# EAGLE schematic AudioCompressor_SCH (EAGLE 7.6.0)
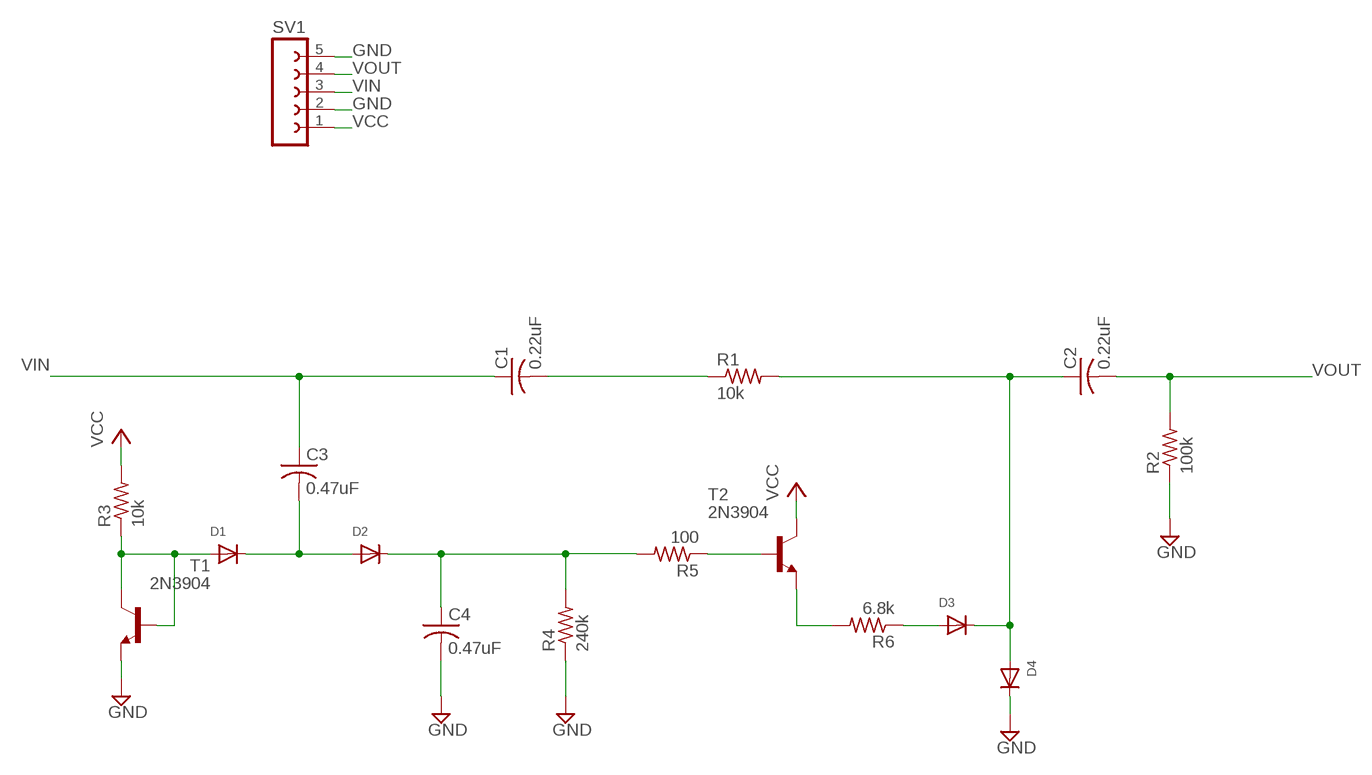
[diagram p0: schematic, sheet 1]

## Parts
C1  0.22uF  C-USC0805  [C0805]
C2  0.22uF  C-USC0805  [C0805]
C3  0.47uF  C-USC0805  [C0805]
C4  0.47uF  C-USC0805  [C0805]
D1  DIODESOD-323F  [SOD-323F]
D2  DIODESOD-323F  [SOD-323F]
D3  DIODESOD-323F  [SOD-323F]
D4  DIODESOD-323F  [SOD-323F]
R1  10k  R-US_R0805  [R0805]
R2  100k  R-US_R0805  [R0805]
R3  10k  R-US_R0805  [R0805]
R4  240k  R-US_R0805  [R0805]
R5  100  R-US_R0805  [R0805]
R6  6.8k  R-US_R0805  [R0805]
SV1  FE05-1  [FE05-1]
T1  2N3904  [TO92]
T2  2N3904  [TO92]

## Nets
GND: C4.2 D4.C R2.1 R4.1 SV1.2 SV1.5 T1.3(E)
N$2: C1.2 R1.1
N$3: C2.1 D3.C D4.A R1.2
N$5: R5.1 T2.2(B)
N$6: C4.1 D2.C R4.2 R5.2
N$7: R6.2 T2.3(E)
N$8: D1.A R3.1 T1.1(C) T1.2(B)
N$9: D3.A R6.1
N$10: C3.2 D1.C D2.A
VCC: R3.2 SV1.1 T2.1(C)
VIN: C1.1 C3.1 SV1.3
VOUT: C2.2 R2.2 SV1.4

## Library data of the parts
C1-C4 = adafruit:C-US: CAPACITOR, American symbol
D1-D4 = adafruit:DIODE: Diode SMADIODE - SMA Surface Mount Package 20V 1A Schottky Diode Digikey: 641-1014-6-ND DO-1N4148 - Through Hole Small Current Diode SOD-123 20V 1 A (.5mV Vf) Schottky Diode - Digikey: MBRX120TPMSCT-ND SOD-323 10V 570mA (.38mV Vf, 3ns) Schottky Diode - Digikey: ZLLS410CT-ND SOD-523 30V 30mA Schottky Diode (RB751S-40TE61) - Digikey: RB751S-40TE61CT-ND SOT23-R/W - SOT23 Package (R = Solder Paste/Reflow Ovens, W = Hand-Soldering) BAT54Film 40V 300mA - Digikey: 497-7162-1-ND
R1-R6 = adafruit:R-US_: RESISTOR, American symbol
SV1 = con-lsta:FE05-1: FEMALE HEADER; OC_FARNELL: unknown; OC_NEWARK: unknown
T1 T2 = transistor:2N3904: NPN TRANSISTOR